# EAGLE design daughter_board (EAGLE 6.3)
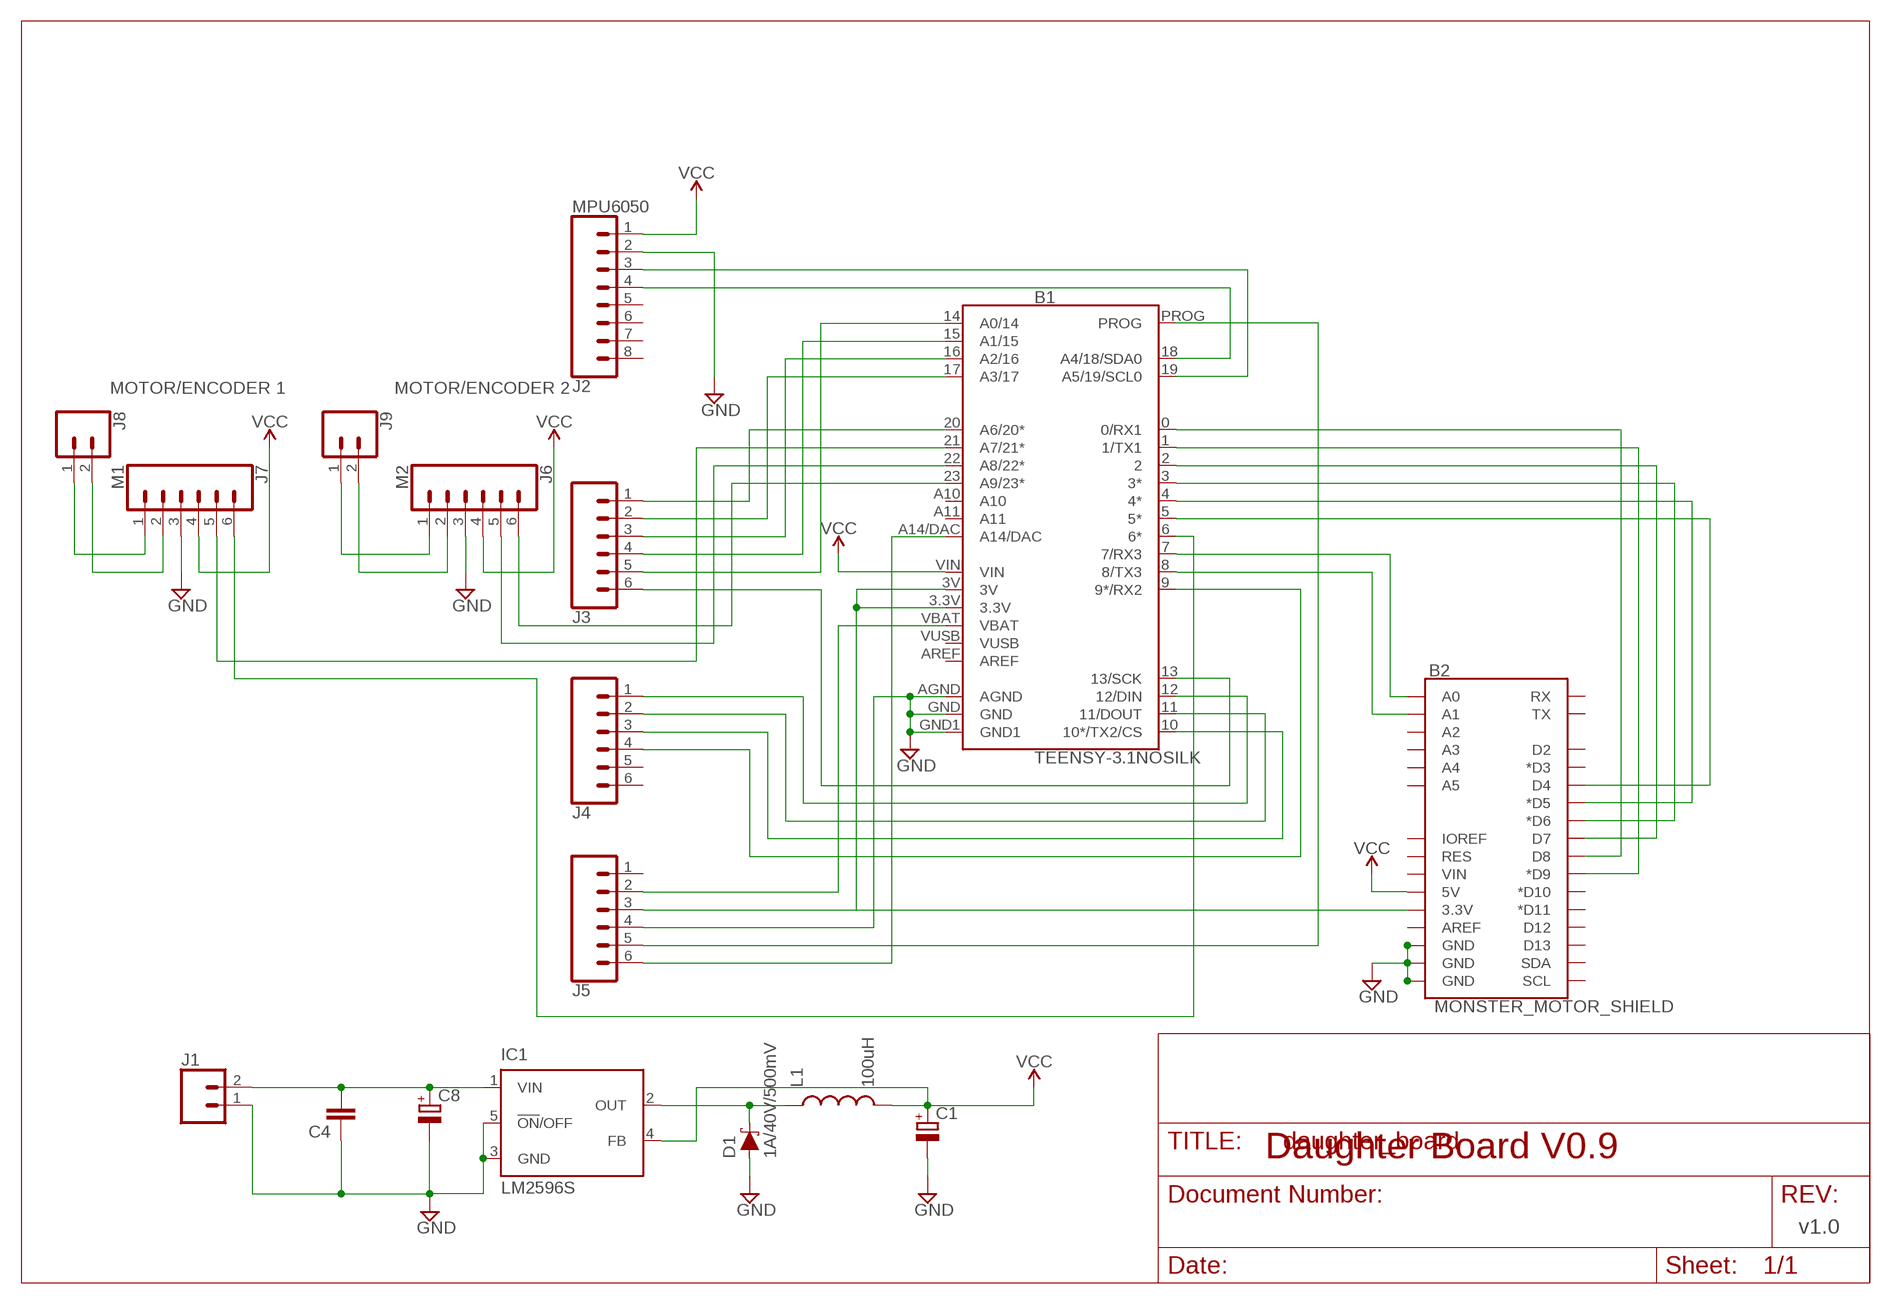
[diagram p0: schematic, sheet 1]

## Parts
B1  TEENSY-3.1NOSILK  [TEENSY-3.1_NOSILK]
B2  MONSTER_MOTOR_SHIELD  ARDUINO_UNO_R3_SHIELDNOLABELS  [UNO_R3_SHIELD_NOLABELS]
C1  CPOL-EU150CLZ-0810  [150CLZ-0810]
C4  C-EUC0805  [C0805]
C8  CPOL-EU150CLZ-0810  [150CLZ-0810]
D1  1A/40V/500mV  DIODE-SCHOTTKY-SS14  [SMA-DIODE]
IC1  LM2596S  [TO263-5]
J1  CONN_023.5MM-NO_SILK  [SCREWTERMINAL-3.5MM-2-NS]
J2  MPU6050  CONN_08NO_SILK_FEMALE_PTH  [1X08_NO_SILK]
J3  CONN_06NO_SILK_FEMALE_PTH  [1X06_NO_SILK]
J4  CONN_06NO_SILK_FEMALE_PTH  [1X06_NO_SILK]
J5  CONN_06NO_SILK_FEMALE_PTH  [1X06_NO_SILK]
J6  M2  CONN_06NO_SILK_FEMALE_PTH  [1X06_NO_SILK]
J7  M1  CONN_06NO_SILK_FEMALE_PTH  [1X06_NO_SILK]
J8  CONN_023.5MM-NO_SILK  [SCREWTERMINAL-3.5MM-2-NS]
J9  CONN_023.5MM-NO_SILK  [SCREWTERMINAL-3.5MM-2-NS]
L1  100uH  INDUCTORPWR  [CDRH125]

## Nets
GND: B1.AGND B1.GND B1.GND1 B2.GND@0(GND) B2.GND@1(GND) B2.GND@2(GND) C1.- C4.1 C8.- D1.A IC1.3(GND) IC1.5(!ON!/OFF) J1.1 J2.2 J5.4 J6.3 J7.3
N$1: B1.19(A5/19/SCL0) J2.3
N$2: B1.18(A4/18/SDA0) J2.4
N$3: B1.20(A6/20*) J3.1
N$4: B1.17(A3/17) J3.2
N$5: B1.16(A2/16) J3.3
N$6: B1.15(A1/15) J3.4
N$7: B1.14(A0/14) J3.5
N$8: B1.13(13/SCK) J3.6
N$9: B1.12(12/DIN) J4.1
N$10: B1.11(11/DOUT) J4.2
N$11: B1.10(10*/TX2/CS) J4.3
N$12: B1.9(9*/RX2) J4.4
N$13: B1.VBAT J5.2
N$14: C4.2 C8.+ IC1.1(VIN) J1.2
N$16: B1.PROG J5.5
N$17: B1.A14/DAC J5.6
N$18: B1.0(0/RX1) B2.D8
N$19: B1.1(1/TX1) B2.D9(*D9)
N$20: B1.2 B2.D7
N$21: B1.3(3*) B2.D6(*D6)
N$22: B1.4(4*) B2.D5(*D5)
N$23: B1.5(5*) B2.D4
N$24: B1.7(7/RX3) B2.A0
N$25: B1.8(8/TX3) B2.A1
N$26: J7.1 J8.1
N$27: J7.2 J8.2
N$28: J6.1 J9.1
N$29: J6.2 J9.2
N$30: B1.3.3V B1.3V B2.3.3V J5.3
N$31: D1.C IC1.2(OUT) L1.1
N$32: B1.23(A9/23*) J6.6
N$33: B1.22(A8/22*) J6.5
N$34: B1.21(A7/21*) J7.5
N$35: B1.6(6*) J7.6
VCC: B1.VIN B2.5V C1.+ IC1.4(FB) J2.1 J6.4 J7.4 L1.2
Unconnected: B1.A10 B1.A11 B1.AREF B2.A2 B2.A3 B2.A4 B2.A5 B2.AREF B2.D2 B2.D3(*D3) B2.D10(*D10) B2.D11(*D11) B2.D12 B2.D13 B2.IOREF B2.RES B2.RX B2.SCL B2.SDA B2.TX B2.VIN J2.5 J2.6 J2.7 J2.8 J4.5 J4.6 J5.1

## Notes on the sheet
- MOTOR/ENCODER 1 | MOTOR/ENCODER 2
- Daughter Board V0.9
- v1.0

## Power pins joined to a net without a drawn wire
VUSB: B1.VUSB

## Library data of the parts
B1 = SparkFun-Boards:TEENSY-3.1: Teensy 3+ Footprint Mechanical footprint with connectors for Teensy Development Board with ARM Cortex. SparkFun Products: Teensy 3.2 <https://www.sparkfun.com/products/13736> Teensy LC <https://www.sparkfun.com/products/13305>; SF_ID: DEV-12646
B2 = SparkFun-Boards:ARDUINO_UNO_R3_SHIELD: Arduino R3 Shield Footprint Shield form compatible with the Arduino Uno R3. SparkFun Products: MG2639 Cellular Shield <https://www.sparkfun.com/products/13120> MIDI Shield <https://www.sparkfun.com/products/12898> R3 Stackable Headers Kit <https://www.sparkfun.com/products/11417>
C1 C8 = resistor:CPOL-EU: POLARIZED CAPACITOR, European symbol
C4 = resistor:C-EU: CAPACITOR, European symbol
D1 = SparkFun-DiscreteSemi:DIODE-SCHOTTKY: Schottky diode A Schottky diode is a semiconductor diode which has a low forward voltage drop and a very fast switching action.; PROD_ID: DIO-08053
IC1 = national-semiconductor:LM2596: SIMPLE SWITCHER® Power Converter 150 kHz 3A Step-Down Voltage Regulator Source: http://www.national.com/ds/LM/LM2596.pdf; MF: NATIONAL SEMICONDUCTOR; MPN: LM2596S-ADJ/NOPB; OC_FARNELL: 9494367; OC_NEWARK: 41K3842
J1 J8 J9 = SparkFun-Connectors:CONN_02: Multi connection point. Often used as Generic Header-pin footprint for 0.1 inch spaced/style header connections On any of the 0.1 inch spaced packages, you can populate with these: Break Away Headers - Straight <https://www.sparkfun.com/products/116> (PRT-00116) Break Away Male Headers - Right Angle <https://www.sparkfun.com/products/553> (PRT-00553) Female Headers <https://www.sparkfun.com/products/115> (PRT-00115) Break Away Headers - Machine Pin <https://www.sparkfun.com/products/117> (PRT-00117) Break Away Female Headers - Swiss Machine Pin <https://www.sparkfun.com/products/743> (PRT-00743) For SCREWTERMINALS and SPRING TERMINALS visit here: Screw Terimnals on SparkFun.com <https://www.sparkfun.com/search/results?term=Screw+Terminals> (5mm/3.5mm/2.54mm spacing) This device is also useful as a general connection point to wire up your design to another part of your project. Our various solder wires solder well into these plated through hole pads. Hook-Up Wire - Assortment (Stranded, 22 AWG) <https://www.sparkfun.com/products/11375> (PRT-11375) Hook-Up Wire - Assortment (Solid Core, 22 AWG) <https://www.sparkfun.com/products/11367> (PRT-11367) View the entire wire category on our website here <https://www.sparkfun.com/categories/141> Special notes: Molex polarized connector foot print use with: PRT-08233 with associated crimp pins and housings. 2.54_SCREWTERM for use with PRT-10571. 3.5mm Screw Terminal footprints for PRT-08084 5mm Screw Terminal footprints for use with PRT-08432; PROD_ID: CONN-08399
J2 = SparkFun-Connectors:CONN_08: Multi connection point. Often used as Generic Header-pin footprint for 0.1 inch spaced/style header connections On any of the 0.1 inch spaced packages, you can populate with these: Break Away Headers - Straight <https://www.sparkfun.com/products/116> (PRT-00116) Break Away Male Headers - Right Angle <https://www.sparkfun.com/products/553> (PRT-00553) Female Headers <https://www.sparkfun.com/products/115> (PRT-00115) Break Away Headers - Machine Pin <https://www.sparkfun.com/products/117> (PRT-00117) Break Away Female Headers - Swiss Machine Pin <https://www.sparkfun.com/products/743> (PRT-00743) Arduino Stackable Header - 8 Pin <https://www.sparkfun.com/products/9279> (PRT-09279) For SCREWTERMINALS and SPRING TERMINALS visit here: Screw Terimnals on SparkFun.com <https://www.sparkfun.com/search/results?term=Screw+Terminals> (5mm/3.5mm/2.54mm spacing) This device is also useful as a general connection point to wire up your design to another part of your project. Our various solder wires solder well into these plated through hole pads. Hook-Up Wire - Assortment (Stranded, 22 AWG) <https://www.sparkfun.com/products/11375> (PRT-11375) Hook-Up Wire - Assortment (Solid Core, 22 AWG) <https://www.sparkfun.com/products/11367> (PRT-11367) View the entire wire category on our website here <https://www.sparkfun.com/categories/141> Special notes: Molex polarized connector foot print use with SKU : PRT-08231 with associated crimp pins and housings. 1MM SMD Version SKU: PRT-10208 NOTES ON THE VARIANTS LOCK and LOCK_LONGPADS... This footprint was designed to help hold the alignment of a through-hole component (i.e. 6-pin header) while soldering it into place. You may notice that each hole has been shifted either up or down by 0.005 of an inch from it's more standard position (which is a perfectly straight line). This slight alteration caused the pins (the squares in the middle) to touch the edges of the holes. Because they are alternating, it causes a "brace" to hold the component in place. 0.005 has proven to be the perfect amount of "off-center" position when using our standard breakaway headers. Although looks a little odd when you look at the bare footprint, once you have a header in there, the alteration is very hard to notice. Also,if you push a header all the way into place, it is covered up entirely on the bottom side.; PROD_ID: CONN-08438
J3-J7 = SparkFun-Connectors:CONN_06: Multi connection point. Often used as Generic Header-pin footprint for 0.1 inch spaced/style header connections On any of the 0.1 inch spaced packages, you can populate with these: Break Away Headers - Straight <https://www.sparkfun.com/products/116> (PRT-00116) Break Away Male Headers - Right Angle <https://www.sparkfun.com/products/553> (PRT-00553) Female Headers <https://www.sparkfun.com/products/115> (PRT-00115) Break Away Headers - Machine Pin <https://www.sparkfun.com/products/117> (PRT-00117) Break Away Female Headers - Swiss Machine Pin <https://www.sparkfun.com/products/743> (PRT-00743) Arduino Stackable Header - 6 Pin <https://www.sparkfun.com/products/9280> (PRT-09280) For SCREWTERMINALS and SPRING TERMINALS visit here: Screw Terimnals on SparkFun.com <https://www.sparkfun.com/search/results?term=Screw+Terminals> (5mm/3.5mm/2.54mm spacing) This device is also useful as a general connection point to wire up your design to another part of your project. Our various solder wires solder well into these plated through hole pads. Hook-Up Wire - Assortment (Stranded, 22 AWG) <https://www.sparkfun.com/products/11375> (PRT-11375) Hook-Up Wire - Assortment (Solid Core, 22 AWG) <https://www.sparkfun.com/products/11367> (PRT-11367) View the entire wire category on our website here <https://www.sparkfun.com/categories/141>; PROD_ID: CONN-08437
L1 = SparkFun-Passives:INDUCTOR: Inductors Basic Inductor/Choke - 0603 and 1206. Footprints are not proven and vary greatly between part numbers. INDUCTOR POWER 3.3UH 4.0A SMD 0.197" L x 0.197" W x 0.177" H (5.00mm x 5.00mm x 4.50mm)

## Board
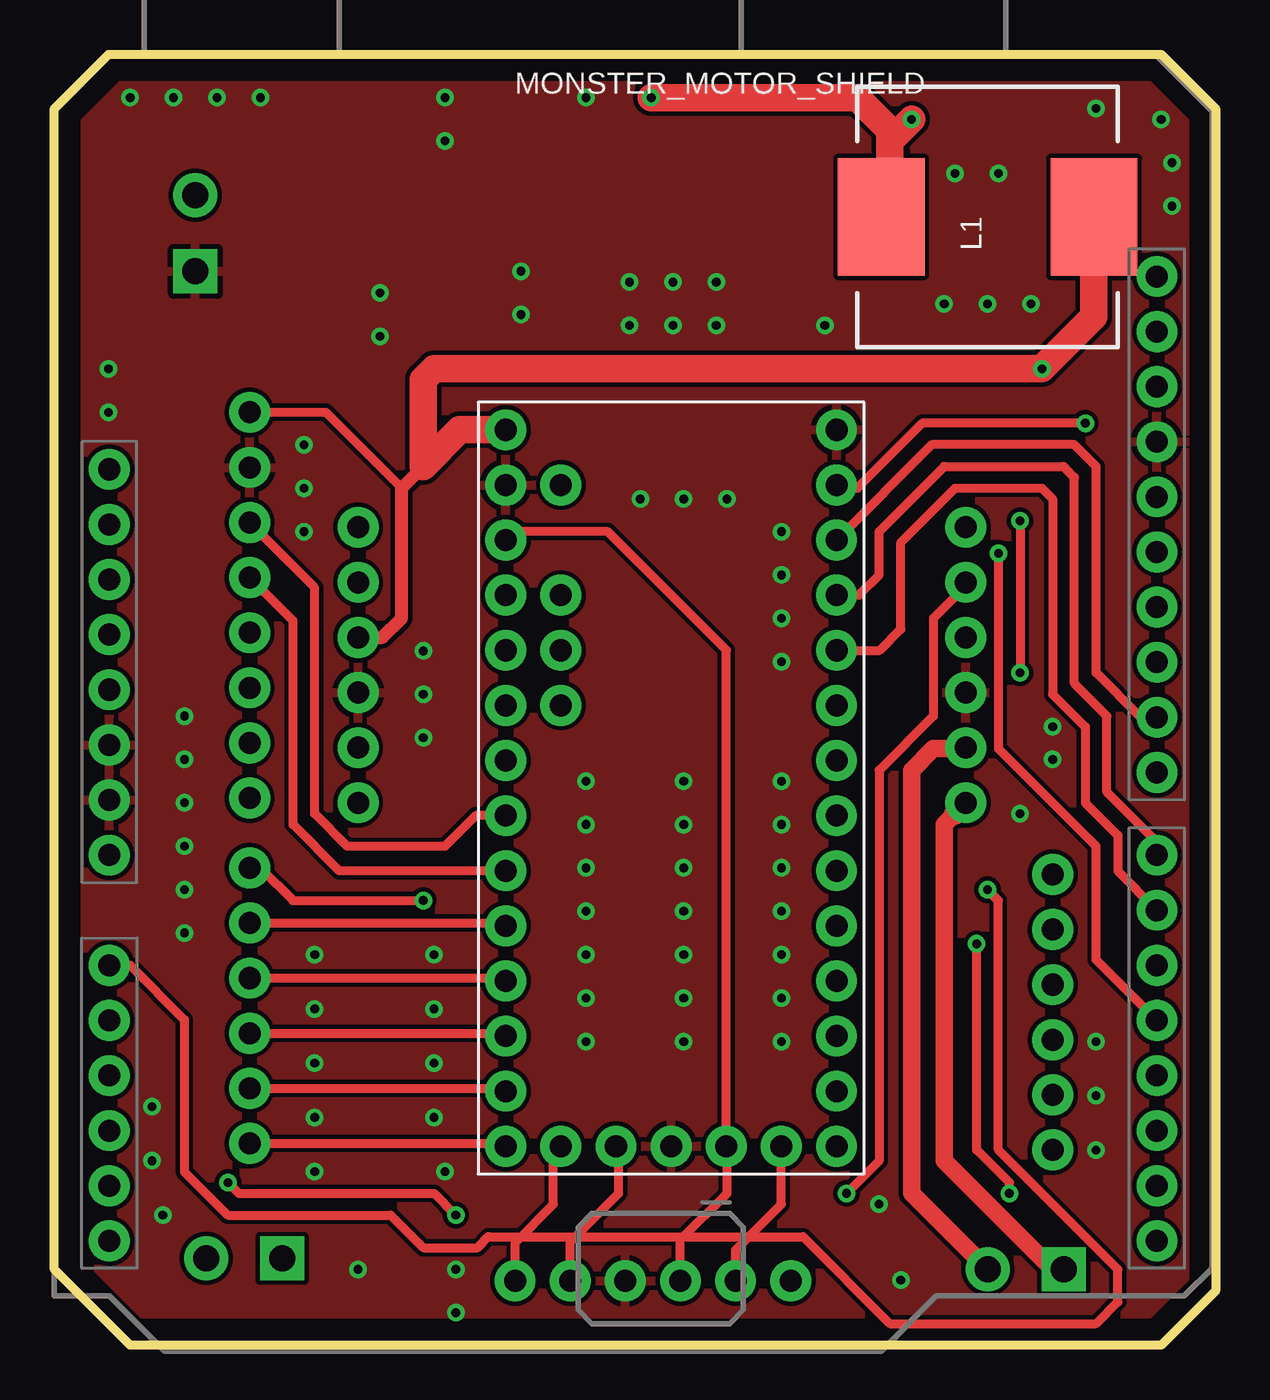
[diagram p1: board, top side]
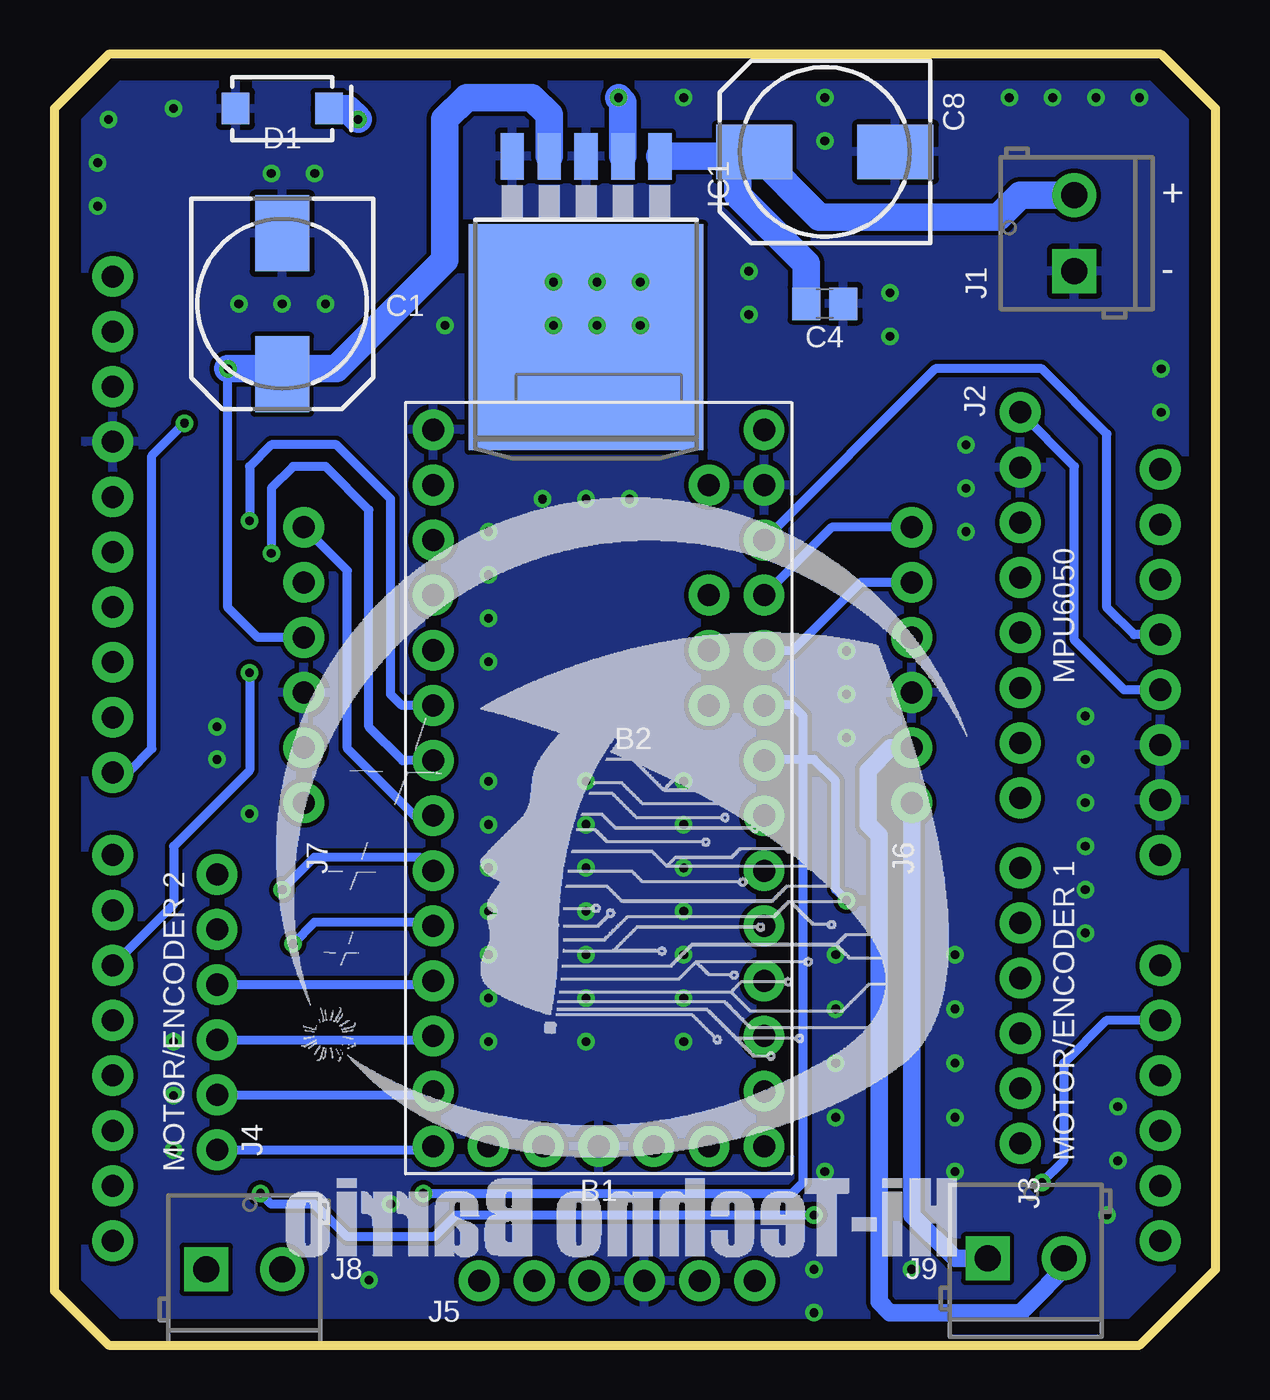
[diagram p2: board, bottom side, seen from below]

Size 53.5 x 59.5 mm. Coordinates in mm from the lower left corner, seen from the top.
Outline: 0,57 2.5,59.5 51,59.5 53.5,57 53.5,2.5 51,0 3.5,0 0,3.5 0,57
Copper layers (1*16): Top 0.035mm / dielectric 1.5mm / Bottom 0.035mm
Design rules "default": minimum track width 10mil, minimum drill 24mil, track to track 8mil, track to pad 8mil, pad to pad 8mil, via to via 8mil, smd to smd 8mil, copper to edge 40mil, drill to drill 8mil, minimum pad ring 10mil, minimum via ring 8mil, stop-mask expansion 4mil, vias tented up to drill 0mil, thermal gap 10mil

### Footprints (pad centres in the part's own frame; a part is rotated, then mirrored left to right if it is on the bottom)
TEENSY-3.1_NOSILK = drill 1.016 pad 1.88: 0 7.62,-13.97; 1 7.62,-11.43; 2 7.62,-8.89; 3 7.62,-6.35; 3.3V 2.54,16.51; 3V -7.62,-11.43; 4 7.62,-3.81; 5 7.62,-1.27; 6 7.62,1.27; 7 7.62,3.81; 8 7.62,6.35; 9 7.62,8.89; 10 7.62,11.43; 11 7.62,13.97; 12 7.62,16.51; 13 -7.62,16.51; 14 -7.62,13.97; 15 -7.62,11.43; 16 -7.62,8.89; 17 -7.62,6.35; 18 -7.62,3.81; 19 -7.62,1.27; 20 -7.62,-1.27; 21 -7.62,-3.81; 22 -7.62,-6.35; 23 -7.62,-8.89; A10 -5.08,-6.35; A11 -5.08,-3.81; A14/DAC -5.08,16.51; AGND -7.62,-13.97; AREF -5.08,-8.89; GND 0,16.51; GND1 7.62,-16.51; PROG -2.54,16.51; VBAT 5.08,16.51; VIN -7.62,-16.51; VUSB -5.08,-13.97
UNO_R3_SHIELD_NOLABELS = drill 1.016 pad 1.88: 3.3V 24.13,-3.81; 5V 24.13,-1.27; A0 24.13,11.43; A1 24.13,13.97; A2 24.13,16.51; A3 24.13,19.05; A4 24.13,21.59; A5 24.13,24.13; AREF -24.13,-15.24; D2 -24.13,19.05; D3 -24.13,16.51; D4 -24.13,13.97; D5 -24.13,11.43; D6 -24.13,8.89; D7 -24.13,6.35; D8 -24.13,2.54; D9 -24.13,0; D10 -24.13,-2.54; D11 -24.13,-5.08; D12 -24.13,-7.62; D13 -24.13,-10.16; GND@0 24.13,1.27; GND@1 24.13,3.81; GND@2 -24.13,-12.7; IOREF 24.13,-8.89; NC 24.13,-11.43; RES 24.13,-6.35; RX -24.13,24.13; SCL -24.13,-20.32; SDA -24.13,-17.78; TX -24.13,21.59; VIN 24.13,6.35
150CLZ-0810 = smd 3.5 x 2.5: + 3.25,0; - -3.25,0
C0805 = smd 1.3 x 1.5: 1 -0.85,0; 2 0.85,0
SMA-DIODE = smd 1.27 x 1.47: A -2.15,0; C 2.15,0
TO263-5 = smd 1.067 x 2.159: 1 -3.404,-5.791; 2 -1.702,-5.791; 3 0,-5.791; 4 1.702,-5.791; 5 3.404,-5.791 | smd 10.8 x 10.41: 6 0,2.54
SCREWTERMINAL-3.5MM-2-NS = drill 1.2 pad 2.032 square: 1 0,0 | drill 1.2 pad 2.032: 2 3.5,0
1X08_NO_SILK = drill 1.016 pad 1.88: 1 0,0; 2 2.54,0; 3 5.08,0; 4 7.62,0; 5 10.16,0; 6 12.7,0; 7 15.24,0; 8 17.78,0
1X06_NO_SILK = drill 1.016 pad 1.88: 1 0,0; 2 2.54,0; 3 5.08,0; 4 7.62,0; 5 10.16,0; 6 12.7,0
CDRH125 = smd 5.4 x 4: 1 0,4.9; 2 0,-4.9

### Placement (x,y rotation side)
B1  28.42,25.68 180 bottom
B2  26.67,28.94 180 top
C1  43,48 270 bottom
C4  18,48 180 bottom
C8  18,55 180 bottom
D1  43,57 0 bottom
IC1  29,49 180 bottom
J1  6.5,49.5 90 bottom
J2  9,43 270 top
J3  9,22 270 top
J4  46,9 90 top
J5  33.93,2.97 180 top
J6  14,25 90 top
J7  42,25 90 top
J8  46.5,3.5 0 bottom
J9  10.5,4 0 bottom
L1  43,52 90 top

### Tracks (layer width: path | path; a pad name or v marks a point on that pad's centre or on a via)
GND  (via drill 0.4)
  other vias: 33.5,37.5 33.5,35.5 33.5,33.5 33.5,31.5 33.5,26 33.5,24 33.5,22 33.5,20 33.5,18 33.5,16 33.5,14 24.5,14 24.5,16 24.5,18 24.5,20 24.5,22 24.5,24 24.5,26 27,39 29,39 31,39 43,48 41,48 45,48 51.5,52.5 51.5,54.5 51,56.5 21.5,49.5 21.5,47.5 15,48.5 15,46.5 11.5,41.5 11.5,39.5 11.5,37.5 6,29 6,27 6,25 6,23 6,21 29,14 29,16 29,26 29,24 39,3 38,6.5 18.5,3.5 18.5,1.5 17.5,10.5 17.5,13 17.5,15.5 17.5,18 12,18 12,15.5 12,13 12,10.5 6,19 17,32 17,30 17,28 41.5,54 43.5,54 48,57 24.5,57.5 18,57.5 18,55.5 2.5,43 3.5,57.5 5.5,57.5 7.5,57.5 9.5,57.5 2.5,45 29,22 29,20 29,18 48,9 48,11.5 48,14 44.5,24.5 26.5,49 28.5,49 30.5,49 30.5,47 28.5,47 26.5,47 46,28.5 46,27 14,3.5 5,6 4.5,8.5 4.5,11 35.5,47 18,8 12,8
  pour Top: 0,60 53,60 53,0 0,0
  pour Bottom: 0,60 53,60 53,0 0,0
N$1
  Top 0.406: B1.19 19.41,24.41 18,23 13.5,23 12,24.5 12,34.92 J2.3
N$2
  Top 0.406: B1.18 13.13,21.87 11,24 11,33.38 J2.4
N$3  (via drill 0.4)
  Top 0.406: J3.1 9.5,22 11,20.5 v17,20.5
  Bottom 0.406: v17,20.5 17.5,21 17.5,26 18.5,27 20.75,27 B1.20
N$4
  Top 0.406: J3.2 20.67,19.46 B1.17
N$5
  Top 0.406: J3.3 20.67,16.92 B1.16
N$6
  Top 0.406: J3.4 20.67,14.38 B1.15
N$7
  Top 0.406: J3.5 20.67,11.84 B1.14
N$8
  Top 0.406: J3.6 20.67,9.3 B1.13
N$9
  Bottom 0.406: J4.1 36.21,9 B1.12
N$10
  Bottom 0.406: J4.2 36.21,11.54 B1.11
N$11
  Bottom 0.406: J4.3 36.21,14.08 B1.10
N$12
  Bottom 0.406: J4.4 36.21,16.62 B1.9
N$13
  Top 0.406: J5.2 31.39,4.39 33.5,6.5 B1.VBAT
N$14
  Bottom 1.27: IC1.1 22,54.79 | 22,54.79 21.46,54.79 C8.+ 18.25,52 10,52 9,53 J1.2 | C4.2 18.85,49.85 22,53 22,54.79
N$16
  Top 0.406: J5.5 23.77,4.77 26,7 26,9.05 B1.PROG
N$17
  Top 0.406: J5.6 21.23,4.73 23,6.5 23,8.83 B1.A14/DAC
N$18  (via drill 0.4)
  Top 0.406: v47.5,42.5 40,42.5 37,39.5 36.19,39.5 B1.0
  Bottom 0.406: B2.D8 50.1,26.4 49,27.5 49,41 v47.5,42.5
N$19
  Top 0.406: B2.D9 50.06,28.94 48,31 48,40.5 47,41.5 40.43,41.5 B1.1
N$20
  Top 0.406: B1.2 37.07,34.57 38,35.5 38,37.5 41,40.5 46.5,40.5 46.75,40.25 47,40 47,30.5 48.5,29 48.5,25.5 50.8,23.2 B2.D7
N$21
  Top 0.406: B1.3 38.03,32.03 39,33 39,37 41.5,39.5 45.5,39.5 46,39 46,30 47.5,28.5 47.5,25 49,23.5 49,21.85 B2.D6
N$22  (via drill 0.4)
  Top 0.406: v44.5,38 v44.5,31
  Bottom 0.406: B1.4 37.49,29.49 38,30 38,39 40.5,41.5 43.5,41.5 44.5,40.5 v44.5,38 | v44.5,31 44.5,26.5 48,23 48,20.31 B2.D5
N$23  (via drill 0.4)
  Top 0.406: v43.5,36.5 43.5,27.5 48,23 48,17.77 B2.D4
  Bottom 0.406: B1.5 37.45,26.95 39,28.5 39,38.5 41,40.5 42.5,40.5 43.5,39.5 v43.5,36.5
N$24  (via drill 0.4)
  Top 0.406: B2.A0 3.49,17.51 6,15 6,8 8,6 15.5,6 17,4.5 19.5,4.5 20,5 34.5,5 38.5,1 48,1 49,2 49,3.5 43.5,9 43.5,20.5 v43,21
  Bottom 0.406: v43,21 41.5,22.5 36.67,22.5 B1.7
N$25  (via drill 0.4)
  Top 0.406: v44,7 44,7.5 42.5,9 v42.5,18.5 | v8,7.5 8.5,7 17.5,7 v18.5,6
  Bottom 0.406: B2.A1 5.03,14.97 7,13 7,8.5 v8,7.5 | v18.5,6 35,6 36,5 40,5 41.5,6.5 43.5,6.5 v44,7 | v42.5,18.5 41.5,19.5 36.21,19.5 B1.8
N$26
  Top 0.813: J8.1 46,3.5 41,8.5 41,24 41.5,24.5
  Top 1.016: 41.5,24.5 J7.1
N$27
  Top 0.813: J8.2 39.5,7 39.5,26.5 40.5,27.5 41.96,27.5 J7.2
N$28
  Bottom 0.813: J6.1 14,6 12,4 J9.1
N$29
  Bottom 0.813: J6.2 14.96,27.54 16,26.5 16,24 15.5,23.5 15.5,2 15,1.5 9,1.5 6.5,4 J9.2
N$30
  Top 0.406: J5.3 28.85,4.85 31,7 31,9.13 B1.3.3V 30.96,32.04 25.5,37.5 21.19,37.5 B1.3V
  Bottom 0.406: B2.3.3V 3.75,32.75 5,34 5,42 8,45 12.91,45 B1.3V
N$31  (via drill 0.4)
  Top 1.27: v27.5,57.5 37,57.5 38.5,56 38.5,55.5 | 38.5,55.5 38.5,52.4 L1.1 | v39.5,56.5 38.5,55.5
  Bottom 1.27: IC1.2 27.3,57.3 v27.5,57.5 | D1.C 40,57 v39.5,56.5
N$32
  Bottom 0.406: J6.6 17.67,37.7 B1.23
N$33
  Bottom 0.406: J6.5 16.34,35.16 19.5,32 20.77,32 B1.22
N$34  (via drill 0.4)
  Top 0.406: J7.5 42,35 40.5,33.5 40.5,29 38,26.5 38,8.5 v36.5,7
  Bottom 0.406: v36.5,7 19.5,7 19,7.5 19,29 19.5,29.5 B1.21
N$35
  Bottom 0.406: B1.6 36.91,24.41 40,27.5 40,35.7 J7.6
VCC  (via drill 0.4)
  Top 0.406: J2.1 12.5,43 16,39.5
  Top 0.61: J6.4 15.12,32.62 16,33.5 16,39.5 17,40.5 18.5,42 20.61,42 B1.VIN
  Top 1.27: L1.2 47.9,47.4 v45.5,45 17.5,45 17,44.5 17,40.5 18.69,42.19 B1.VIN
  Bottom 0.406: J7.4 44.12,32.62 45.5,34 v45.5,45 | B2.5V 4.21,30.21 6.5,32.5 6.5,40.5 J2.1
  Bottom 1.27: IC1.4 30.7,56.7 31.5,57.5 34.5,57.5 35.5,56.5 35.5,50 40.5,45 42.75,45 C1.+ 43.25,45 v45.5,45

### Text on the board
bNames: + | - | MPU6050 | MOTOR/ENCODER 1 | MOTOR/ENCODER 2